# Altium schematic sheet PLL.SchDoc (part 3 of 3)
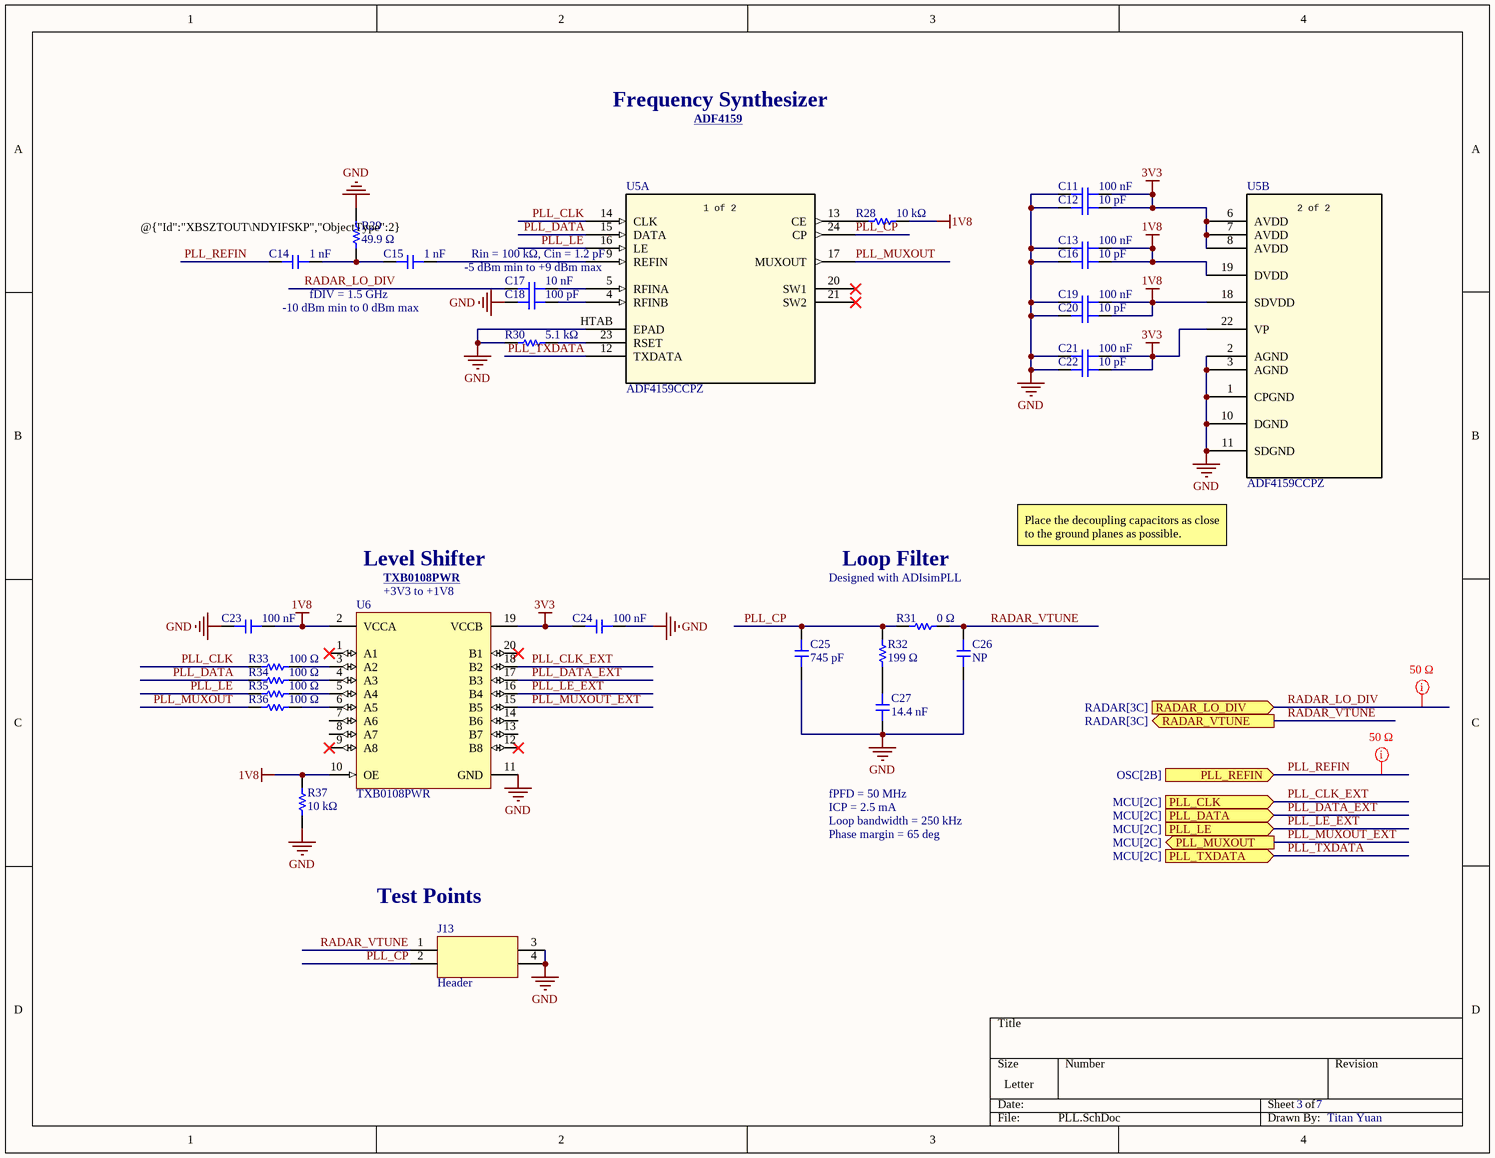
[diagram p2: PLL.SchDoc]

## Library data of the parts (continued)
U5 = ADF4159CCPZ: IC Pll Freq Synthesizer 24LFCSP "IC 13GHZ 1 24-WFQFN Exposed Pad, Csp"; Manufacturer_Name: Analog Devices Inc; Manufacturer: Analog Devices; Manufacturer Lifecycle Status: PRODUCTION; Input: CMOS; Max Supply Current: 40mA; Max Supply Voltage: 3.45V; Min Supply Voltage: 2.7V; Nominal Supply Current: 33mA; Number of Circuits: 1; PLL: Yes; Copyright: Copyright (C) 2025 Ultra Librarian. All rights reserved.; Manufacturer_Part_Number: ADF4159CCPZ; RefDes: RefDes; Type: Type; Supplier: Arrow Electronics; Supplier Part Number: ADF4159CCPZ; Manufacturer Part Number: ADF4159CCPZ; RoHS: Compliant; Category: Clock Generators, PLLs, Frequency Synthesizers; Stock: 16; Pricing: 1=14.01, 10=12.76 (USD); Case/Package: LFCSP EP; Frequency: 13GHz; Height: 750µm; Lead Free: Contains Lead; Length: 4.1mm; Lifecycle Status: Production; Clock Frequency: 13GHz; Max Operating Temperature: 125°C; Min Operating Temperature: -40°C; Mounting Technology: Surface Mount; Number of Outputs: 1; Pins: 24; Operating Supply Current: 40mA; Radiation Hardening: No; REACH SVHC: No; Schedule B: 8542390000, 8542390000|8542390000|8542390000|8542390000|8542390000|8542390000|8542390000|8542390000|8542390000|8542390000|8542390000|8542390000|8542390000|8542390000|8542390000|8542390000|8542390000|8542390000|8542390000|8542390000|8542390000|8542390000|8542390000|85; Width: 4.1mm; ComponentLink1URL: https://datasheet.octopart.com:443/ADF4159CCPZ-Analog-Devices-datasheet-28359207.pdf?src-supplier=Newark; ComponentLink1Description: https://datasheet.octopart.com:443/ADF4159CCPZ-Analog-Devices-datasheet-28359207.pdf?src-supplier=Newark; ComponentLink2URL: https://datasheet.octopart.com:443/ADF4159CCPZ-Analog-Devices-datasheet-23761417.pdf?src-supplier=Newark; ComponentLink2Description: https://datasheet.octopart.com:443/ADF4159CCPZ-Analog-Devices-datasheet-23761417.pdf?src-supplier=Newark; ComponentLink3URL: https://datasheet.octopart.com:443/ADF4159CCPZ-Analog-Devices-datasheet-11761967.pdf?src-supplier=Newark; ComponentLink3Description: https://datasheet.octopart.com:443/ADF4159CCPZ-Analog-Devices-datasheet-11761967.pdf?src-supplier=Newark; ComponentLink4URL: https://octopart.com:443/opatz8j6/c1?t=sFpxmdEK-TpWxew3lQPHWXAdM5czz84jkTjdAblxL2FLtgSnnJtHzcZ7eDVrY5wUr_SVqsz_Dp2fz8ZtN6lVO8uzYTTInUBy26MK382qZeiAUDaS88UR4ELIN2ZU7XFIVaK4UL8ObL4flxWtc7ks8pYJfkdBDqO7QR7iH-p_7135f50wuHOzpbmA4pBW-bckYVq5mgo5pYPHvD0dMhS4_c77dJySLl7uu4XVnigltr6SOw_ybHZCS7HIqQ2lc5ypX2E6NLk_TCC2erJi_2-Ybzi1S5UkxB_CfPGHcszzu0v9JbzFJPfherc&src-supplier=Analog+Devices; ComponentLink4Description: https://octopart.com:443/opatz8j6/c1?t=sFpxmdEK-TpWxew3lQPHWXAdM5czz84jkTjdAblxL2FLtgSnnJtHzcZ7eDVrY5wUr_SVqsz_Dp2fz8ZtN6lVO8uzYTTInUBy26MK382qZeiAUDaS88UR4ELIN2ZU7XFIVaK4UL8ObL4flxWtc7ks8pYJfkdBDqO7QR7iH-p_7135f50wuHOzpbmA4pBW-bckYVq5mgo5pYPHvD0dMhS4_c77dJySLl7uu4XVnigltr6SOw_ybHZCS7HIqQ2lc5ypX2E6NLk_TCC2erJi_2-Ybzi1S5UkxB_CfPGHcszzu0v9JbzFJPfherc&src-supplier=Analog+Devices; ComponentLink5URL: https://datasheet.octopart.com:443/ADF4159CCPZ-Analog-Devices-datasheet-101563325.pdf?src-supplier=Augswan; ComponentLink5Description: https://datasheet.octopart.com:443/ADF4159CCPZ-Analog-Devices-datasheet-101563325.pdf?src-supplier=Augswan; ComponentLink6URL: https://datasheet.octopart.com:443/ADF4159CCPZ-Analog-Devices-datasheet-16077098.pdf?src-supplier=element14+APAC; ComponentLink6Description: https://datasheet.octopart.com:443/ADF4159CCPZ-Analog-Devices-datasheet-16077098.pdf?src-supplier=element14+APAC; ComponentLink7URL: https://datasheet.octopart.com:443/ADF4159CCPZ-Analog-Devices-datasheet-140566762.pdf?src-supplier=Arrow.cn; ComponentLink7Description: https://datasheet.octopart.com:443/ADF4159CCPZ-Analog-Devices-datasheet-140566762.pdf?src-supplier=Arrow.cn; ComponentLink8URL: http://sigma.octopart.com:80/conflict_mineral_statement/Analog-Devices-company-33.pdf?src-supplier=Compliance+Statements; ComponentLink8Description: http://sigma.octopart.com:80/conflict_mineral_statement/Analog-Devices-company-33.pdf?src-supplier=Compliance+Statements; ComponentLink9URL: https://octopart.com:443/opatz8j6/c1?t=4AUWQOYY8hDK56fWYIFCkzZGK-WlRlfj3W59qJ6lN0Or0dqBi-BZtouAdLLcZ0g9GpUibARjvwKelFok923HesNjOwvjJbGuJIFFDtkFLQoAtw9O0oSsPiBrvEsgVLQ8yyZZa0MUOvDC9pb6dfm0a_5Zj_Vp7K3DrxroK-yAUp5WMn8ukNugC5wnzgVIb4QKMMJ7PwoxZFfV1QgXJzgUp4ZWxSHfn6Mn-DyBM67ES7wx5acptrPz2a-iVPxqbhd_bTw80SeUQ9yQIgwDbxKtCFSTQqp_tPFf7XLfJysxGOlPYb3Go66K7jI&src-supplier=Compliance+Statements; ComponentLink9Description: https://octopart.com:443/opatz8j6/c1?t=4AUWQOYY8hDK56fWYIFCkzZGK-WlRlfj3W59qJ6lN0Or0dqBi-BZtouAdLLcZ0g9GpUibARjvwKelFok923HesNjOwvjJbGuJIFFDtkFLQoAtw9O0oSsPiBrvEsgVLQ8yyZZa0MUOvDC9pb6dfm0a_5Zj_Vp7K3DrxroK-yAUp5WMn8ukNugC5wnzgVIb4QKMMJ7PwoxZFfV1QgXJzgUp4ZWxSHfn6Mn-DyBM67ES7wx5acptrPz2a-iVPxqbhd_bTw80SeUQ9yQIgwDbxKtCFSTQqp_tPFf7XLfJysxGOlPYb3Go66K7jI&src-supplier=Compliance+Statements
U6 = TXB0108PWR: 8-Bit Bidirectional Voltage-Level Shifter with Auto Direction Sensing and +/-15-kV ESD Protect 20-TSSOP -40 to 85; Manufacturer: Texas Instruments; Manufacturer Lifecycle Status: ACTIVE; Manufacturer Package Identifier: PW (R-PDSO-G**); Data Rate: 100Mbps; High Level Output Current: -20µA; Logic Function: Translator; Low Level Output Current: 20µA; Max Supply Voltage: 5.5V; Min Supply Voltage: 1.65V; Number of Bits: 8; Propagation Delay: 4ns; Quiescent Current: 3.5µA; Rise Time: 7.3ns; Topology: Push-Pull; Turn-On Delay Time: 9.5ns; Manufacturer Part Number: TXB0108PWR; Supplier: DigiKey; Supplier Part Number: 296-21527-1-ND; RoHS: Compliant; Category: Voltage Level Shifters; Stock: 22043; Pricing: 1=1.82, 10=1.338, 25=1.2176, 100=1.0851, 250=1.02184, 500=1.01132 (USD); Case/Package: TSSOP; Contact Plating: Gold; Height: 0m; Lead Free: Lead Free; Length: 6.5mm; Lifecycle Status: Production; Max Operating Temperature: 85°C; Min Operating Temperature: -40°C; Mounting Technology: Surface Mount; Number of Channels: 8; Number of Inputs: 8; Pins: 20; Output Current: 20µA; Radiation Hardening: No; REACH SVHC: No; Schedule B: 8542390000, 8542390000|8542390000|8542390000|8542390000|8542390000; Termination: SMD/SMT; Thickness: 1mm; Weight: 76.997305mg; Width: 4.4mm; ComponentLink1URL: https://sigma.octopart.com:443/157851284/technical_drawing/Texas-Instruments-TXB0108PWR.pdf?src-supplier=Texas+Instruments; ComponentLink1Description: https://sigma.octopart.com:443/157851284/technical_drawing/Texas-Instruments-TXB0108PWR.pdf?src-supplier=Texas+Instruments; ComponentLink2URL: https://octopart.com:443/opatz8j6/c1?t=LySuUYxN9QFMmqSZ0iSTBK1M-CfND3iA45F57-rgipnbsICCknTkoBhUukg2AkZDEL0aXzWd55iRogxa7qKL4TXUNFi6ipSyGXAAa9LZBdmP_Kv4vGBHh0qj-vgKaBFsF-d5KwYEI23cSnz-pp69Sgcy-_vsa0CB7mKhHXjctGx33TVX4QZBqIYpXxZkCgRNByv7fiJueXud0UX45YityO0p_-WYUGRJV_eJOGa4Ay7QQ8FZc3uEUNlVrkxXjQZMNFnbfnrSKCgesFBqhoNiKT25AC3yNUdmgJ7FLN5_z4zOzP0RR75DYkH4GMBnBzaYVRF7L7HNXVjS4Tp9-MFjD_sEQ-aCybQglHE52PnZL4JsgTDjFwelFwDtaMk_UKSdWjy_&src-supplier=Texas+Instruments; ComponentLink2Description: https://octopart.com:443/opatz8j6/c1?t=LySuUYxN9QFMmqSZ0iSTBK1M-CfND3iA45F57-rgipnbsICCknTkoBhUukg2AkZDEL0aXzWd55iRogxa7qKL4TXUNFi6ipSyGXAAa9LZBdmP_Kv4vGBHh0qj-vgKaBFsF-d5KwYEI23cSnz-pp69Sgcy-_vsa0CB7mKhHXjctGx33TVX4QZBqIYpXxZkCgRNByv7fiJueXud0UX45YityO0p_-WYUGRJV_eJOGa4Ay7QQ8FZc3uEUNlVrkxXjQZMNFnbfnrSKCgesFBqhoNiKT25AC3yNUdmgJ7FLN5_z4zOzP0RR75DYkH4GMBnBzaYVRF7L7HNXVjS4Tp9-MFjD_sEQ-aCybQglHE52PnZL4JsgTDjFwelFwDtaMk_UKSdWjy_&src-supplier=Texas+Instruments; ComponentLink3URL: https://datasheet.octopart.com:443/TXB0108PWR-Texas-Instruments-datasheet-34148259.pdf?src-supplier=Texas+Instruments; ComponentLink3Description: https://datasheet.octopart.com:443/TXB0108PWR-Texas-Instruments-datasheet-34148259.pdf?src-supplier=Texas+Instruments; ComponentLink4URL: https://datasheet.octopart.com:443/TXB0108PWR-Texas-Instruments-datasheet-11474939.pdf?src-supplier=Texas+Instruments; ComponentLink4Description: https://datasheet.octopart.com:443/TXB0108PWR-Texas-Instruments-datasheet-11474939.pdf?src-supplier=Texas+Instruments; ComponentLink5URL: https://datasheet.octopart.com:443/TXB0108PWR-Texas-Instruments-datasheet-10384694.pdf?src-supplier=Texas+Instruments; ComponentLink5Description: https://datasheet.octopart.com:443/TXB0108PWR-Texas-Instruments-datasheet-10384694.pdf?src-supplier=Texas+Instruments; ComponentLink6URL: https://datasheet.octopart.com:443/TXB0108PWR-Texas-Instruments-datasheet-10258393.pdf?src-supplier=Texas+Instruments; ComponentLink6Description: https://datasheet.octopart.com:443/TXB0108PWR-Texas-Instruments-datasheet-10258393.pdf?src-supplier=Texas+Instruments; ComponentLink7URL: https://sigma.octopart.com:443/49249835/technical_drawing/Texas-Instruments-TXB0108PWR.pdf?src-supplier=Texas+Instruments; ComponentLink7Description: https://sigma.octopart.com:443/49249835/technical_drawing/Texas-Instruments-TXB0108PWR.pdf?src-supplier=Texas+Instruments; ComponentLink8URL: https://datasheet.octopart.com:443/TXB0108PWR-Texas-Instruments-datasheet-37744618.pdf?src-supplier=Farnell; ComponentLink8Description: https://datasheet.octopart.com:443/TXB0108PWR-Texas-Instruments-datasheet-37744618.pdf?src-supplier=Farnell; ComponentLink9URL: https://datasheet.octopart.com:443/TXB0108PWR-Texas-Instruments-datasheet-8559414.pdf?src-supplier=Farnell; ComponentLink9Description: https://datasheet.octopart.com:443/TXB0108PWR-Texas-Instruments-datasheet-8559414.pdf?src-supplier=Farnell; ComponentLink10URL: https://datasheet.octopart.com:443/TXB0108PWR-Texas-Instruments-datasheet-5368061.pdf?src-supplier=Farnell; ComponentLink10Description: https://datasheet.octopart.com:443/TXB0108PWR-Texas-Instruments-datasheet-5368061.pdf?src-supplier=Farnell; ComponentLink11URL: https://datasheet.octopart.com:443/TXB0108PWR-Texas-Instruments-datasheet-66618004.pdf?src-supplier=Farnell; ComponentLink11Description: https://datasheet.octopart.com:443/TXB0108PWR-Texas-Instruments-datasheet-66618004.pdf?src-supplier=Farnell; ComponentLink12URL: https://datasheet.octopart.com:443/TXB0108PWR-Texas-Instruments-datasheet-48033010.pdf?src-supplier=Farnell; ComponentLink12Description: https://datasheet.octopart.com:443/TXB0108PWR-Texas-Instruments-datasheet-48033010.pdf?src-supplier=Farnell; ComponentLink13URL: https://datasheet.octopart.com:443/TXB0108PWR-Texas-Instruments-datasheet-10542789.pdf?src-supplier=Farnell; ComponentLink13Description: https://datasheet.octopart.com:443/TXB0108PWR-Texas-Instruments-datasheet-10542789.pdf?src-supplier=Farnell; ComponentLink14URL: https://datasheet.octopart.com:443/TXB0108PWR-Texas-Instruments-datasheet-151942.pdf?src-supplier=Upverter; ComponentLink14Description: https://datasheet.octopart.com:443/TXB0108PWR-Texas-Instruments-datasheet-151942.pdf?src-supplier=Upverter; ComponentLink15URL: https://datasheet.octopart.com:443/TXB0108PWR-Texas-Instruments-datasheet-11536343.pdf?src-supplier=Upverter; ComponentLink15Description: https://datasheet.octopart.com:443/TXB0108PWR-Texas-Instruments-datasheet-11536343.pdf?src-supplier=Upverter; ComponentLink16URL: https://datasheet.octopart.com:443/TXB0108PWR-Texas-Instruments-datasheet-33012939.pdf?src-supplier=element14+APAC; ComponentLink16Description: https://datasheet.octopart.com:443/TXB0108PWR-Texas-Instruments-datasheet-33012939.pdf?src-supplier=element14+APAC; ComponentLink17URL: https://datasheet.octopart.com:443/TXB0108PWR-Texas-Instruments-datasheet-165804950.pdf?src-supplier=LCSC; ComponentLink17Description: https://datasheet.octopart.com:443/TXB0108PWR-Texas-Instruments-datasheet-165804950.pdf?src-supplier=LCSC; ComponentLink18URL: https://datasheet.octopart.com:443/TXB0108PWR-Texas-Instruments-datasheet-159118386.pdf?src-supplier=LCSC; ComponentLink18Description: https://datasheet.octopart.com:443/TXB0108PWR-Texas-Instruments-datasheet-159118386.pdf?src-supplier=LCSC; ComponentLink19URL: https://datasheet.octopart.com:443/TXB0108PWR-Texas-Instruments-datasheet-137316104.pdf?src-supplier=Future+Electronics; ComponentLink19Description: https://datasheet.octopart.com:443/TXB0108PWR-Texas-Instruments-datasheet-137316104.pdf?src-supplier=Future+Electronics; ComponentLink20URL: https://datasheet.octopart.com:443/TXB0108PWR-Texas-Instruments-datasheet-14151550.pdf?src-supplier=iiiC; ComponentLink20Description: https://datasheet.octopart.com:443/TXB0108PWR-Texas-Instruments-datasheet-14151550.pdf?src-supplier=iiiC; ComponentLink21URL: https://datasheet.octopart.com:443/TXB0108PWR-Texas-Instruments-datasheet-126938.pdf?src-supplier=DigiKey; ComponentLink21Description: https://datasheet.octopart.com:443/TXB0108PWR-Texas-Instruments-datasheet-126938.pdf?src-supplier=DigiKey; ComponentLink22URL: http://sigma.octopart.com:80/reach_statement/Texas-Instruments-company-64.pdf?src-supplier=Compliance+Statements; ComponentLink22Description: http://sigma.octopart.com:80/reach_statement/Texas-Instruments-company-64.pdf?src-supplier=Compliance+Statements; ComponentLink23URL: http://sigma.octopart.com:80/conflict_mineral_statement/Texas-Instruments-company-63.pdf?src-supplier=Compliance+Statements; ComponentLink23Description: http://sigma.octopart.com:80/conflict_mineral_statement/Texas-Instruments-company-63.pdf?src-supplier=Compliance+Statements